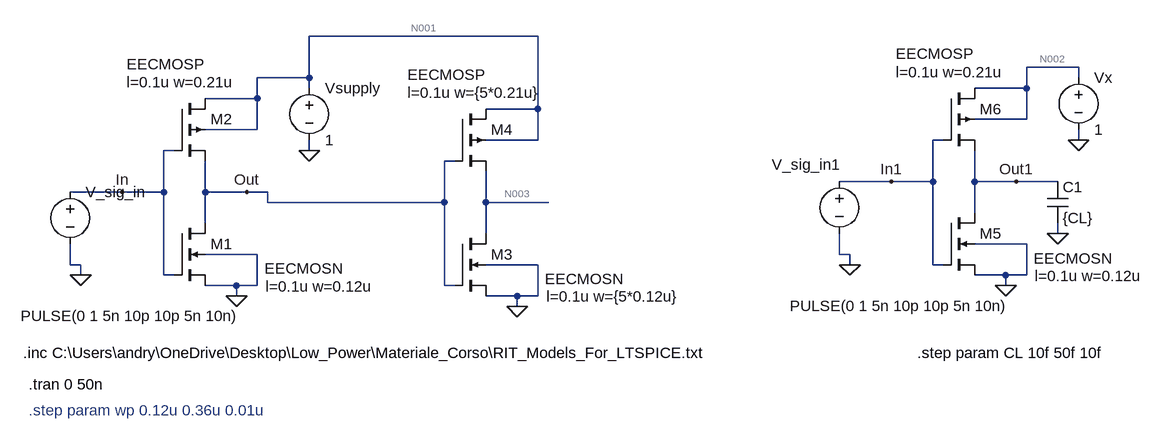
[diagram p0: schematic Esercitazione_2.asc]
Esercitazione_2.asc, the LTspice schematic file:
Version 4
SHEET 1 1700 680
WIRE 736 -96 384 -96
WIRE 1568 -48 1488 -48
WIRE 384 -32 384 -96
WIRE 384 -32 304 -32
WIRE 1568 -32 1568 -48
WIRE 384 -16 384 -32
WIRE 1488 -16 1488 -48
WIRE 1488 -16 1408 -16
WIRE 304 0 304 -32
WIRE 304 0 224 0
WIRE 736 16 736 -96
WIRE 736 16 656 16
WIRE 1488 32 1488 -16
WIRE 1488 32 1408 32
WIRE 304 48 304 0
WIRE 304 48 224 48
WIRE 736 64 736 16
WIRE 736 64 656 64
WIRE 1360 64 1344 64
WIRE 1568 64 1568 48
WIRE 176 80 160 80
WIRE 384 80 384 64
WIRE 608 96 592 96
WIRE 1280 128 1200 128
WIRE 1344 128 1344 64
WIRE 1344 128 1280 128
WIRE 1408 128 1408 80
WIRE 1472 128 1408 128
WIRE 1536 128 1472 128
WIRE 96 144 16 144
WIRE 160 144 160 80
WIRE 160 144 96 144
WIRE 224 144 224 96
WIRE 288 144 224 144
WIRE 320 144 288 144
WIRE 320 160 320 144
WIRE 592 160 592 96
WIRE 592 160 320 160
WIRE 656 160 656 112
WIRE 752 160 656 160
WIRE 1408 176 1408 128
WIRE 224 192 224 144
WIRE 656 208 656 160
WIRE 1536 208 1536 192
WIRE 1488 224 1408 224
WIRE 304 240 224 240
WIRE 1200 240 1200 208
WIRE 1216 240 1200 240
WIRE 16 256 16 224
WIRE 32 256 16 256
WIRE 736 256 656 256
WIRE 1216 256 1216 240
WIRE 1344 256 1344 128
WIRE 1360 256 1344 256
WIRE 32 272 32 256
WIRE 160 272 160 144
WIRE 176 272 160 272
WIRE 1456 272 1408 272
WIRE 1488 272 1488 224
WIRE 1488 272 1456 272
WIRE 272 288 224 288
WIRE 304 288 304 240
WIRE 304 288 272 288
WIRE 592 288 592 160
WIRE 608 288 592 288
WIRE 1456 288 1456 272
WIRE 272 304 272 288
WIRE 704 304 656 304
WIRE 736 304 736 256
WIRE 736 304 704 304
WIRE 704 320 704 304
FLAG 272 304 0
FLAG 384 80 0
FLAG 32 272 0
FLAG 288 144 Out
FLAG 96 144 In
FLAG 704 320 0
FLAG 1456 288 0
FLAG 1568 64 0
FLAG 1216 256 0
FLAG 1472 128 Out1
FLAG 1280 128 In1
FLAG 1536 208 0
SYMBOL nmos4 176 192 R0
WINDOW 3 139 70 Left 2
WINDOW 123 141 97 Left 2
SYMATTR Value EECMOSN
SYMATTR Value2 l=0.1u w=0.12u
SYMATTR InstName M1
SYMBOL pmos4 176 0 R0
WINDOW 3 -73 -53 Left 2
WINDOW 123 -73 -25 Left 2
SYMATTR Value EECMOSP
SYMATTR Value2 l=0.1u w=0.21u
SYMATTR InstName M2
SYMBOL voltage 16 128 R0
WINDOW 3 -76 207 Left 2
WINDOW 123 0 0 Left 0
WINDOW 39 0 0 Left 0
SYMATTR Value PULSE(0 1 5n 10p 10p 5n 10n)
SYMATTR InstName V_sig_in
SYMBOL voltage 384 -32 R0
WINDOW 123 0 0 Left 0
WINDOW 39 0 0 Left 0
SYMATTR InstName Vsupply
SYMATTR Value 1
SYMBOL nmos4 608 208 R0
WINDOW 3 139 70 Left 2
WINDOW 123 141 97 Left 2
SYMATTR Value EECMOSN
SYMATTR Value2 l=0.1u w={5*0.12u}
SYMATTR InstName M3
SYMBOL pmos4 608 16 R0
WINDOW 3 -73 -53 Left 2
WINDOW 123 -73 -25 Left 2
SYMATTR Value EECMOSP
SYMATTR Value2 l=0.1u w={5*0.21u}
SYMATTR InstName M4
SYMBOL nmos4 1360 176 R0
WINDOW 3 139 70 Left 2
WINDOW 123 141 97 Left 2
SYMATTR Value EECMOSN
SYMATTR Value2 l=0.1u w=0.12u
SYMATTR InstName M5
SYMBOL pmos4 1360 -16 R0
WINDOW 3 -73 -53 Left 2
WINDOW 123 -73 -25 Left 2
SYMATTR Value EECMOSP
SYMATTR Value2 l=0.1u w=0.21u
SYMATTR InstName M6
SYMBOL voltage 1200 112 R0
WINDOW 3 -76 207 Left 2
WINDOW 123 0 0 Left 0
WINDOW 39 0 0 Left 0
WINDOW 0 -104 -10 Left 2
SYMATTR Value PULSE(0 1 5n 10p 10p 5n 10n)
SYMATTR InstName V_sig_in1
SYMBOL voltage 1568 -48 R0
WINDOW 123 0 0 Left 0
WINDOW 39 0 0 Left 0
SYMATTR InstName Vx
SYMATTR Value 1
SYMBOL cap 1520 128 R0
SYMATTR InstName C1
SYMATTR Value {CL}
TEXT -56 392 Left 2 !.inc C:\\Users\\andry\\OneDrive\\Desktop\\Low_Power\\Materiale_Corso\\RIT_Models_For_LTSPICE.txt
TEXT -48 440 Left 2 !.tran 0 50n
TEXT -48 480 Left 2 ;.step param wp 0.12u 0.36u 0.01u
TEXT 1320 392 Left 2 !.step param CL 10f 50f 10f

The netlist it stands for:
* Esercitazione_2.asc
M1 Out In 0 0 EECMOSN l=0.1u w=0.12u
M2 N001 In Out N001 EECMOSP l=0.1u w=0.21u
V_sig_in In 0 PULSE(0 1 5n 10p 10p 5n 10n)
Vsupply N001 0 1
M3 N003 Out 0 0 EECMOSN l=0.1u w={5*0.12u}
M4 N001 Out N003 N001 EECMOSP l=0.1u w={5*0.21u}
M5 Out1 In1 0 0 EECMOSN l=0.1u w=0.12u
M6 N002 In1 Out1 N002 EECMOSP l=0.1u w=0.21u
V_sig_in1 In1 0 PULSE(0 1 5n 10p 10p 5n 10n)
Vx N002 0 1
C1 Out1 0 {CL}
.model NMOS NMOS
.model PMOS PMOS
.lib standard.mos
.inc C:\Users\andry\OneDrive\Desktop\Low_Power\Materiale_Corso\RIT_Models_For_LTSPICE.txt
.tran 0 50n
* .step param wp 0.12u 0.36u 0.01u
.step param CL 10f 50f 10f
.backanno
.end

* Results of the author's LTspice run, read from the files saved beside the schematic
* Operating Point (first step), zero values left out:
*   V(out) = 999.9 mV
*   V(n001) = 1 V
*   V(n003) = 143.3 µV
*   V(out1) = 999.9 mV
*   V(n002) = 1 V
*   Id(M6) = 6.593 nA
*   Is(M6) = -6.593 nA
*   Id(M4) = 71.39 nA
*   Ib(M4) = 1.01 pA
*   Is(M4) = -71.39 nA
*   Id(M2) = 6.593 nA
*   Is(M2) = -6.593 nA
*   Id(M5) = 6.593 nA
*   Ib(M5) = -1.01 pA
*   Is(M5) = -6.592 nA
*   Id(M3) = 71.39 nA
*   Is(M3) = -71.39 nA
*   Id(M1) = 6.593 nA
*   Ib(M1) = -1.01 pA
*   Is(M1) = -6.592 nA
*   I(Vx) = -6.593 nA
*   I(Vsupply) = -77.99 nA
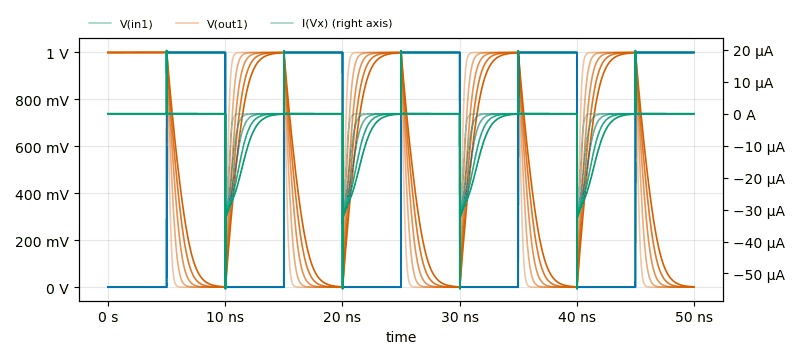
[diagram p1: Transient Analysis of Esercitazione_2.asc, plotted from the saved traces]
* Transient Analysis, 5 runs:
*   V(in1) [run 1]: min 0 V, max 1 V, average 500.7 mV, rms 707.4 mV, last 1 V
*   V(in1) [run 2]: min 0 V, max 1 V, average 500.7 mV, rms 707.4 mV, last 1 V
*   V(in1) [run 3]: min 0 V, max 1 V, average 500.7 mV, rms 707.4 mV, last 1 V
*   V(in1) [run 4]: min 0 V, max 1 V, average 500.7 mV, rms 707.4 mV, last 1 V
*   V(in1) [run 5]: min 0 V, max 1 V, average 500.7 mV, rms 707.4 mV, last 1 V
*   V(out1) [run 1]: min -6.883 mV, max 1.009 V, average 505.7 mV, rms 699 mV, last 64.97 µV
*   V(out1) [run 2]: min -3.469 mV, max 1.005 V, average 511.7 mV, rms 691.3 mV, last 64.98 µV
*   V(out1) [run 3]: min -2.299 mV, max 1.003 V, average 517.8 mV, rms 683.6 mV, last 70.98 µV
*   V(out1) [run 4]: min -1.536 mV, max 1.002 V, average 523.9 mV, rms 675.8 mV, last 251.3 µV
*   V(out1) [run 5]: min 63.94 µV, max 1.002 V, average 530 mV, rms 668 mV, last 1.525 mV
*   I(Vx) [run 1]: min -54.79 µA, max 19.84 µA, average -833.2 nA, rms 4.363 µA, last -5.411 nA
*   I(Vx) [run 2]: min -54.74 µA, max 19.77 µA, average -1.632 µA, rms 6.023 µA, last -5.411 nA
*   I(Vx) [run 3]: min -54.72 µA, max 19.75 µA, average -2.431 µA, rms 7.316 µA, last -5.411 nA
*   I(Vx) [run 4]: min -54.71 µA, max 19.74 µA, average -3.23 µA, rms 8.414 µA, last -5.407 nA
*   I(Vx) [run 5]: min -54.69 µA, max 19.73 µA, average -4.02 µA, rms 9.377 µA, last -5.384 nA